# Altium project TIDA-01486.PrjPcb (part 2 of 2)
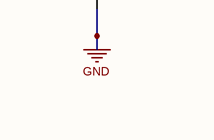
[diagram p8: TIDA-01486E1_Schematic.SchDoc, bottom right]

## Sheet TIDA-01486E1_Schematic.SchDoc: Schematic (continued)

### Library data of the parts
C1 C5 = GRM188R71H102JA01D: CAP, CERM, 1000 pF, 50 V,+/- 5%, X7R, 0603; Manufacturer: MuRata; Polarized: N; CompType: Capacitor; Value: 1000pF; U/M: EA; Cap_F: 0.000000001; Tolerance_%: 5; Value1: Unknown; VDC_V: 50; Value2: 50V; TaMin_C: -55; TaMax_C: 125; SizeArea_mm2: 1.28; SizeAreaWB_mm2: 4.68; SizeX_mm: 1.6; SizeY_mm: 0.8; SizeZ_mm: 1; AEC Category: Q200; SymbolVersion: 2008-07-09; PartNumber: GRM188R71H102JA01D; PackageReference: 0603; RoHS: Y; MountType: SMT; Technology: Ceramic; TempCo: X7R; Cap_Case: 0603; Published: 2008-06-19; Publisher: Texas Instruments; LatestRevisionDate: 2017-06-02; ComponentLink1Description: Datasheet link; ComponentLink1URL: http://psearch.murata.com/capacitor/product/GRM188R71H102JA01%23.pdf; Supplier 1: Digi-Key; Supplier Part Number 1: 490-9733-1-ND; Supplier 2: Mouser; Supplier Part Number 2: 81-GRM39X102J50D; AEC Qualified: N; AEC Grade: N/A
C9 C10 C17 C39 C?#27 C?#29 = GRM155R71E104KE14D: CAP, CERM, 0.1 µF, 25 V,+/- 10%, X7R, 0402; Manufacturer: MuRata; Polarized: N; CompType: Capacitor; Value: 0.1uF; U/M: EA; Cap_F: 0.0000001; Tolerance_%: 10; Value1: Unknown; VDC_V: 25; Value2: 25V; TaMin_C: -55; TaMax_C: 125; SizeArea_mm2: 0.5; SizeAreaWB_mm2: 3; SizeX_mm: 1; SizeZ_mm: 0.6; AEC Category: Q200; Green_Lifecycle: Active; Green_REACh: Passed; SymbolVersion: 2008-07-09; PartNumber: GRM155R71E104KE14D; PackageReference: 0402; RoHS: Y; MountType: SMT; Technology: Ceramic; TempCo: X7R; Cap_Case: 0402; SizeY_mm: 0.5; Published: 2008-06-19; Publisher: Texas Instruments; LatestRevisionDate: 2017-06-02; ComponentLink1Description: Datasheet link; ComponentLink1URL: http://search.murata.co.jp/Ceramy/image/img/A01X/G101/ENG/GRM155R71E104KE14-01.pdf; Supplier 1: Digi-Key; Supplier Part Number 1: 490-10698-1-ND; Supplier 2: Newark; Supplier Part Number 2: 31Y1751; Supplier 3: Mouser; Supplier Part Number 3: 81-GRM155R71E104KE4D; AEC Qualified: N; AEC Grade: N/A; Green_EU RoHS: Passed; Green_EU RoHS-2: Incomplete
C27 C31 C35 C40 C?#26 C?#28 = TPSA685K020R1000: CAP, TA, 6.8 µF, 20 V, +/- 10%, 1 ohm, SMD; Manufacturer: AVX; Polarized: Y; CompType: Capacitor; Value: 6.8uF; U/M: EA; Cap_F: 0.0000068; Tolerance_%: 10; Value1: 1 ohm; VDC_V: 20; Value2: 20V; ESR_ohm: 1; IRMS_A: 0.246; TaMin_C: -55; TaMax_C: 125; Cap_Case: A; SizeAreaWB_mm2: 10.92; SizeArea_mm2: 5.12; SizeX_mm: 3.2; SizeY_mm: 1.6; SizeZ_mm: 1.8; AEC Category: Q200; SymbolVersion: 2008-07-09; PartNumber: TPSA685K020R1000; PackageReference: 3216-18; RoHS: Y; MountType: SMT; Technology: TA; Series: TPS; Publisher: Texas Instruments; LatestRevisionDate: 2017-03-13; LatestRevisionNote: Updated supplier links; ComponentLink1Description: Datasheet link; ComponentLink1URL: http://www.avx.com/docs/masterpubs/tantniob.pdf; Supplier 1: Digi-Key; Supplier Part Number 1: 478-3094-1-ND; Supplier 2: Newark; Supplier Part Number 2: 75M2902; Supplier 3: Mouser; Supplier Part Number 3: 581-TPSA685K020R1000; AEC Qualified: ?
C47 = GMK107AB7105KAHT: CAP, CERM, 1 µF, 35 V,+/- 10%, X7R, AEC-Q200 Grade 0, 0603; Manufacturer: Taiyo Yuden; Polarized: N; CompType: Capacitor; Value: 1uF; U/M: EA; Cap_F: 0.000001; Tolerance_%: 10; Value1: Unknown; VDC_V: 35; Value2: 35V; TaMin_C: -55; TaMax_C: 125; SizeArea_mm2: 1.28; SizeAreaWB_mm2: 4.68; SizeX_mm: 1.6; SizeY_mm: 0.8; SizeZ_mm: 1; AEC Category: Q200; AEC Qualified: Y; AEC Grade: 0; SymbolVersion: 2008-07-09; PartNumber: GMK107AB7105KAHT; PackageReference: 0603; RoHS: Y; MountType: SMT; Technology: Ceramic; TempCo: X7R; Cap_Case: 0603; Published: 2008-06-19; Publisher: Texas Instruments; LatestRevisionDate: 2017-06-02; ComponentLink1Description: Datasheet link; ComponentLink1URL: http://www.yuden.co.jp/productdata/catalog/en/mlcc01_hq_e.pdf; Supplier 1: Digi-Key; Supplier Part Number 1: 587-3352-1-ND; Supplier 2: Newark; Supplier Part Number 2: 68X1426; Supplier 3: Mouser; Supplier Part Number 3: 963-GMK107AB7105KAHT
C?#1 = CAP_CER_GP_100nF_10%_50V_X7R_0603: Capacitor ceramic multilayer SMD 100nF 10% X7R 50V 0603; Manufacturer: TDK; Manufacturer Part Number: C1608X7R1H104K080AA; PartCode: 1; Type: standard; Case-EIA: 0603; Case-Metric: 1608; GR: BUCK; Part Number: CAP_CER_GP_100nF_10%_50V_X7R_0603; Class: Capacitor Ceramic Multilayer; Class Code: CAP_CER; Tolerance: 10%; Temperature_code: X7R; ComponentLink1Description: Datasheet; ComponentLink1URL: http://www.mouser.com/ds/2/400/mlcc_commercial_general_en-266370.pdf; ComponentLink2Description: Data; ComponentLink2URL: https://product.tdk.com/en/search/capacitor/ceramic/mlcc/info?part_no=C1608X7R1H104K080AA; ComponentLink3Description: Mouser; ComponentLink3URL: http://www.mouser.com/search/ProductDetail.aspx?R=0virtualkey0virtualkeyC1608X7R1H104K080AA
C?#2 C?#5 C?#9 = CAP_CER_GP_15uF_20%_16V_X5R_1210: Capacitor ceramic multilayer SMD 15uF 20% X5R 16V 1210; Manufacturer: TDK; Manufacturer Part Number: C3225X5R1C156M250AA; PartCode: 1; Type: standard; Case-EIA: 1210; Case-Metric: 3225; Part Number: CAP_CER_GP_15uF_20%_16V_X5R_1210; Class: Capacitor Ceramic Multilayer; Class Code: CAP_CER; Tolerance: 20%; Temperature_code: X5R; ComponentLink1Description: Datasheet; ComponentLink1URL: http://www.mouser.com/ds/2/400/mlcc_commercial_general_en-266370.pdf; ComponentLink2Description: Data; ComponentLink2URL: https://product.tdk.com/en/search/capacitor/ceramic/mlcc/info?part_no=C3225X5R1C156M250AA; ComponentLink3Description: Mouser; ComponentLink3URL: http://www.mouser.com/search/ProductDetail.aspx?R=0virtualkey0virtualkeyC3225X5R1C156M250AA
C?#3 C?#6 C?#7 C?#35 = CAP_CER_GP_100nF_20%_50V_X5R_0603: Capacitor ceramic multilayer SMD 100nF 20% X5R 50V 0603; Manufacturer: TDK; Manufacturer Part Number: C1608X5R1H104M080AA; PartCode: 1; Type: standard; Case-EIA: 0603; Case-Metric: 1608; Part Number: CAP_CER_GP_100nF_20%_50V_X5R_0603; Class: Capacitor Ceramic Multilayer; Class Code: CAP_CER; Tolerance: 20%; Temperature_code: X5R; ComponentLink1Description: Datasheet; ComponentLink1URL: http://www.mouser.com/ds/2/400/mlcc_commercial_general_en-266370.pdf; ComponentLink2Description: Data; ComponentLink2URL: https://product.tdk.com/en/search/capacitor/ceramic/mlcc/info?part_no=C1608X5R1H104M080AA; ComponentLink3Description: Mouser; ComponentLink3URL: http://www.mouser.com/search/ProductDetail.aspx?R=0virtualkey0virtualkeyC1608X5R1H104M080AA
C?#4 = CAP_CER_GP_68pF_1%_50V_C0G_0603: Capacitor ceramic multilayer SMD 68pF 1% C0G 50V 0603; Manufacturer: TDK; Manufacturer Part Number: C1608C0G1H680F080AA; PartCode: 1; Type: standard; Case-EIA: 0603; Case-Metric: 1608; GR: BUCK; Part Number: CAP_CER_GP_68pF_1%_50V_C0G_0603; Class: Capacitor Ceramic Multilayer; Class Code: CAP_CER; Tolerance: 1%; Temperature_code: C0G; ComponentLink1Description: Datasheet; ComponentLink1URL: http://www.mouser.com/ds/2/400/mlcc_commercial_general_en-266370.pdf; ComponentLink2Description: Data; ComponentLink2URL: https://product.tdk.com/en/search/capacitor/ceramic/mlcc/info?part_no=C1608C0G1H680F080AA; ComponentLink3Description: Mouser; ComponentLink3URL: http://www.mouser.com/search/ProductDetail.aspx?R=0virtualkey0virtualkeyC1608C0G1H680F080AA
C?#8 = CAP_CER_GP_1uF_20%_10V_X5R_0603: Capacitor ceramic multilayer SMD 1uF 20% X5R 10V 0603; Manufacturer: TDK; Manufacturer Part Number: C1608X5R1A105M080AC; PartCode: 1; Type: standard; Case-EIA: 0603; Case-Metric: 1608; Part Number: CAP_CER_GP_1uF_20%_10V_X5R_0603; Class: Capacitor Ceramic Multilayer; Class Code: CAP_CER; Tolerance: 20%; Temperature_code: X5R; ComponentLink1Description: Datasheet; ComponentLink1URL: http://www.mouser.com/ds/2/400/mlcc_commercial_general_en-266370.pdf
C?#10 C?#11 = GRM1555C1H102JA01D: CAP, CERM, 1000 pF, 50 V, +/- 5%, C0G/NP0, 0402; Manufacturer: MuRata; Value: 1000pF; Polarized: N; CompType: Capacitor; U/M: EA; Cap_F: 0.000000001; Tolerance_%: 5; Value1: Unknown; VDC_V: 50; Value2: 50V; TaMin_C: -55; TaMax_C: 125; Cap_Case: 0402; AEC Category: Q200; Published: 2008-06-19; LatestRevisionDate: 2016-04-09; PackageReference: 0402; Publisher: Texas Instruments; SymbolVersion: 2008-07-09; PartNumber: GRM1555C1H102JA01D; RoHS: Y; MountType: SMT; Technology: Ceramic; TempCo: C0G/NP0; ComponentLink1Description: Datasheet link; ComponentLink1URL: http://search.murata.co.jp/Ceramy/PnsearchViewAction.do?HnOFG=ON&HnNFG=ON&SEL_CNT=50&sLang=en&sKey=GRM1555C1H102JA01D&x=9&y=9&search=startwith; Supplier 1: Digi-Key; Supplier Part Number 1: 490-3244-1-ND; Supplier 2: Mouser; Supplier Part Number 2: 81-GRM1555C1H102JA1D; Supplier 3: Farnell; Supplier Part Number 3: 8819556; AEC Qualified: ?
C?#12 = GRM188R71A105KA61D: CAP, CERM, 1 µF, 10 V, +/- 10%, X7R, 0603; Manufacturer: MuRata; Polarized: N; CompType: Capacitor; Value: 1uF; U/M: EA; Cap_F: 0.000001; Tolerance_%: 10; ESR_ohm: 0.011; Value1: 0.011 ohm; Value2: 10V; TaMin_C: -55; TaMax_C: 125; Cap_Case: 0603; AEC Category: Q200; SizeArea_mm2: 1.28; SizeAreaWB_mm2: 4.68; SizeX_mm: 1.6; SizeY_mm: 0.8; SizeZ_mm: 1; SymbolVersion: 2008-07-09; PartNumber: GRM188R71A105KA61D; PackageReference: 0603; RoHS: Y; VDC_V: 10; MountType: SMT; Technology: Ceramic; TempCo: X7R; Published: 2008-06-19; Publisher: Texas Instruments; LatestRevisionDate: 2016-05-21; ComponentLink1Description: Datasheet link; ComponentLink1URL: http://search.murata.co.jp/Ceramy/PnsearchViewAction.do?HnOFG=ON&HnNFG=ON&SEL_CNT=50&sLang=en&sKey=GRM188R71A105KA61D&x=9&y=9&search=startwith; Supplier 1: Digi-Key; Supplier Part Number 1: 490-3899-1-ND; Supplier 2: Mouser; Supplier Part Number 2: 81-GRM188R71A105KA1D; Supplier 3: Farnell; Supplier Part Number 3: 1845766; AEC Qualified: ?
C?#13-C?#15 = GRM188R71A105KA61D: CAP, CERM, 1 µF, 10 V, +/- 10%, X7R, 0603; Manufacturer: MuRata; Polarized: N; CompType: Capacitor; Value: 1uF; U/M: EA; Cap_F: 0.000001; Tolerance_%: 10; ESR_ohm: 0.011; Value1: 0.011 ohm; Value2: 10V; TaMin_C: -55; TaMax_C: 125; Cap_Case: 0603; SizeArea_mm2: 1.28; SizeAreaWB_mm2: 4.68; SizeX_mm: 1.6; SizeY_mm: 0.8; SizeZ_mm: 1; AEC Category: Q200; SymbolVersion: 2008-07-09; PartNumber: GRM188R71A105KA61D; PackageReference: 0603; RoHS: Y; VDC_V: 10; MountType: SMT; Technology: Ceramic; TempCo: X7R; Published: 2008-06-19; Publisher: Texas Instruments; LatestRevisionDate: 2016-05-21; ComponentLink1Description: Datasheet link; ComponentLink1URL: http://search.murata.co.jp/Ceramy/PnsearchViewAction.do?HnOFG=ON&HnNFG=ON&SEL_CNT=50&sLang=en&sKey=GRM188R71A105KA61D&x=9&y=9&search=startwith; Supplier 1: Digi-Key; Supplier Part Number 1: 490-3899-1-ND; Supplier 2: Mouser; Supplier Part Number 2: 81-GRM188R71A105KA1D; Supplier 3: Farnell; Supplier Part Number 3: 1845766; AEC Qualified: ?
C?#16 C?#17 = GRM21BR60J476ME15L: CAP, CERM, 47 µF, 6.3 V, +/- 20%, X5R, 0805; Manufacturer: MuRata; Polarized: N; CompType: Capacitor; Value: 47uF; U/M: EA; Cap_F: 0.000047; Tolerance_%: 20; Value1: Unknown; VDC_V: 6.3; Value2: 6.3V; TaMin_C: -55; TaMax_C: 85; Cap_Case: 0805; AEC Category: Q200; SizeArea_mm2: 2.5; SizeAreaWB_mm2: 6.75; SizeX_mm: 2; SizeY_mm: 1.25; SizeZ_mm: 1.45; SymbolVersion: 2008-07-09; PartNumber: GRM21BR60J476ME15L; PackageReference: 0805; RoHS: Y; MountType: SMT; Technology: Ceramic; TempCo: X5R; Published: 2008-06-19; Publisher: Texas Instruments; LatestRevisionDate: 2016-05-21; ComponentLink1Description: Datasheet link; ComponentLink1URL: http://psearch.en.murata.com/capacitor/product/GRM21BR60J476ME15%23.pdf; Supplier 1: Digi-Key; Supplier Part Number 1: 490-9960-1-ND; Supplier 2: Mouser; Supplier Part Number 2: 81-GRM21BR60J476ME5L; Supplier 3: Farnell; Supplier Part Number 3: 2362109; AEC Qualified: N; AEC Grade: N/A
C?#18-C?#21 C?#34 = GRM155R71C104KA88D: CAP, CERM, 0.1 µF, 16 V, +/- 10%, X7R, 0402; Manufacturer: MuRata; Value: 0.1uF; Polarized: N; CompType: Capacitor; U/M: EA; Cap_F: 0.0000001; Tolerance_%: 10; Value1: Unknown; VDC_V: 16; Value2: 16V; TaMin_C: -55; TaMax_C: 125; Cap_Case: 0402; AEC Category: Q200; Published: 2008-06-19; LatestRevisionDate: 2016-03-01; PackageReference: 0402; Publisher: Texas Instruments; SymbolVersion: 2008-07-09; PartNumber: GRM155R71C104KA88D; RoHS: Y; MountType: SMT; Technology: Ceramic; TempCo: X7R; ComponentLink1Description: Datasheet link; ComponentLink1URL: http://search.murata.co.jp/Ceramy/PnsearchViewAction.do?HnOFG=ON&HnNFG=ON&SEL_CNT=50&sLang=en&sKey=GRM155R71C104KA88D&x=9&y=9&search=startwith; Supplier 1: Digi-Key; Supplier Part Number 1: 490-3261-1-ND; Supplier 2: Mouser; Supplier Part Number 2: 81-GRM155R71C104KA88; Supplier 3: Farnell; Supplier Part Number 3: 8819742; AEC Qualified: ?
C?#22-C?#25 = GRM1555C1H120JA01D: CAP, CERM, 12 pF, 50 V, +/- 5%, C0G/NP0, 0402; Manufacturer: MuRata; Polarized: N; CompType: Capacitor; Value: 12pF; U/M: EA; Cap_F: 0.000000000012; Tolerance_%: 5; Value1: Unknown; VDC_V: 50; Value2: 50V; TaMin_C: -55; TaMax_C: 125; SizeArea_mm2: 0.5; SizeAreaWB_mm2: 3; SizeX_mm: 1; SizeZ_mm: 0.6; AEC Category: Q200; SymbolVersion: 2008-07-09; PartNumber: GRM1555C1H120JA01D; PackageReference: 0402; RoHS: Y; MountType: SMT; Technology: Ceramic; TempCo: C0G/NP0; Cap_Case: 0402; SizeY_mm: 0.5; Published: 2008-06-19; Publisher: Texas Instruments; ComponentLink1Description: Datasheet link; ComponentLink1URL: http://search.murata.co.jp/Ceramy/PnsearchViewAction.do?HnOFG=ON&HnNFG=ON&SEL_CNT=50&sLang=en&sKey=GRM1555C1H120JA01D&x=9&y=9&search=startwith; Supplier 1: Mouser; Supplier Part Number 1: 81-GRM1555C1H120JA1D; Supplier 2: Farnell; Supplier Part Number 2: 1828875; Supplier 3: Newark; Supplier Part Number 3: 14T3292; AEC Qualified: ?
  C?#22 C?#23: LatestRevisionDate: 2017-01-30
  C?#24 C?#25: LatestRevisionDate: 2016-11-28
C?#30 C?#33 = GRM1555C1H120JA01D: CAP, CERM, 12 pF, 50 V, +/- 5%, C0G/NP0, 0402; Manufacturer: MuRata; Value: 12pF; Polarized: N; CompType: Capacitor; U/M: EA; Cap_F: 0.000000000012; Tolerance_%: 5; Value1: Unknown; VDC_V: 50; Value2: 50V; TaMin_C: -55; TaMax_C: 125; Cap_Case: 0402; AEC Category: Q200; Published: 2008-06-19; LatestRevisionDate: 2016-04-09; PackageReference: 0402; Publisher: Texas Instruments; SymbolVersion: 2008-07-09; PartNumber: GRM1555C1H120JA01D; RoHS: Y; MountType: SMT; Technology: Ceramic; TempCo: C0G/NP0; ComponentLink1Description: Datasheet link; ComponentLink1URL: http://search.murata.co.jp/Ceramy/PnsearchViewAction.do?HnOFG=ON&HnNFG=ON&SEL_CNT=50&sLang=en&sKey=GRM1555C1H120JA01D&x=9&y=9&search=startwith; Supplier 1: Mouser; Supplier Part Number 1: 81-GRM1555C1H120JA1D; Supplier 2: Farnell; Supplier Part Number 2: 1828875; Supplier 3: Newark; Supplier Part Number 3: 14T3292; AEC Qualified: ?
C?#31 C?#32 = EMK107BB7225MA-T: CAP, CERM, 2.2 µF, 16 V,+/- 10%, X7R, 0603; Manufacturer: Taiyo Yuden; Polarized: N; CompType: Capacitor; Value: 2.2uF; U/M: EA; Cap_F: 0.0000022; Tolerance_%: 10; Value1: Unknown; VDC_V: 16; Value2: 16V; TaMin_C: -55; TaMax_C: 125; SizeArea_mm2: 1.28; SizeAreaWB_mm2: 4.68; SizeX_mm: 1.6; SizeY_mm: 0.8; SizeZ_mm: 1; AEC Category: Q200; SymbolVersion: 2008-07-09; PartNumber: EMK107BB7225MA-T; PackageReference: 0603; RoHS: Y; MountType: SMT; Technology: Ceramic; TempCo: X7R; Cap_Case: 0603; Published: 2008-06-19; Publisher: Texas Instruments; LatestRevisionDate: 2017-06-02; ComponentLink1Description: Datasheet link; ComponentLink1URL: http://www.yuden.co.jp/productdata/catalog/en/mlcc_all_e.pdf; Supplier 1: Digi-Key; Supplier Part Number 1: 587-4864-1-ND; Supplier 2: Mouser; Supplier Part Number 2: 963-EMK107BB7225MA-T; AEC Qualified: N; AEC Grade: N/A
Cin?#1 Cin?#2 Cin_?#1-Cin_?#4 = C0603C105K8PACTU: Manufacturer Name: Kemet; PackageReference: C0603C105K8PACTU; Manufacturer Part Number: C0603C105K8PACTU
Cout?#1 Cout?#2 = CL32B106KBJNNWE: Manufacturer Name: Samsung Electro-Mechanics; PackageReference: CL32B106KBJNNWE; Manufacturer Part Number: CL32B106KBJNNWE
D1 = DFLS130L-7: Diode, Schottky, 30 V, 1 A, PowerDI123; Manufacturer: Diodes Inc.; U/M: EA; Vf_V: 0.31; Value: 30V; Value1: 1A; Value2: 0.31V; Io_A: 1; Vr_V: 30; TJmax_C: 125; SizeAreaWB_mm2: 13.066; SizeArea_mm2: 6.586; SizeX_mm: 3.7; SizeY_mm: 1.78; SizeZ_mm: 0.98; AEC Category: Q101; AEC Qualified: N; Green_Lifecycle: Not Set; Green_REACh: Incomplete; CompType: Diode; SymbolVersion: 2008-12-08; PartNumber: DFLS130L-7; PackageReference: PowerDI123; MountType: SMT; Type: Schottky; RoHS: Y; Published: 2008-06-26; Publisher: Texas Instruments; LatestRevisionDate: 2017-05-30; ComponentLink1Description: Datasheet link; ComponentLink1URL: http://www.diodes.com/_files/datasheets/ds30492.pdf; Supplier 1: Digi-Key; Supplier Part Number 1: DFLS130LDICT-ND; Supplier 2: Newark; Supplier Part Number 2: 12T1975; Supplier 3: Mouser; Supplier Part Number 3: 621-DFLS130L; Green_EU RoHS: Incomplete; Green_EU RoHS-2: Incomplete
D5-D7 = CMP-0029001-1: Diode, Ultrafast, 100 V, 0.15 A, SOD-123; Manufacturer: Diodes Inc.; Io_A: 1.5dA; Green_Lifecycle: Active; SizeAreaWB_mm2: 13.095; Vr_V: 100V; Green_REACh: Passed; Value1: 0.15A; TJmax_C: 150°C; U/M: EA; Value: 100V; SizeZ_mm: 1.35; SizeX_mm: 3.85; SizeY_mm: 1.7; Vf_V: 1.25V; SizeArea_mm2: 6.545; AEC Category: Q101; ComponentLink1URL: http://www.diodes.com/datasheets/ds30086.pdf; Supplier Part Number 2: 621-1N4148W-F; Publisher: Texas Instruments; Supplier 2: Mouser; Supplier Part Number 3: 1776392; Supplier 3: Farnell; Published: 2008-06-26; RoHS: Y; MountType: SMT; Green_EU RoHS-2: Passed; Supplier 1: Digi-Key; Green_EU RoHS: Passed; PackageReference: SOD-123; Value2: 1.25V; CompType: Diode; Type: Ultrafast; LatestRevisionDate: 2017-05-08; PartNumber: 1N4148W-7-F; AEC Qualified: ?; ComponentLink1Description: Datasheet link; Supplier Part Number 1: 1N4148W-FDICT-ND
D?#1 = S3A: Part Number: S3A; Manufacturer: Fairchild; PartCode: 3; Type: standard; Class: Si-Diode; STD Price: 0.114; Class Code: Diode; Case-EIA: SMC; Manufacturer Part Number: S3A
D?#2 = LTST-C190KSKT: LED ULTRA-BRIGHT YELLOW SMT 0603; Manufacturer: Lite ON; PartCode: 1; Type: standard; Class: LED YEL; STD Price: 0.057; Case-EIA: 0603; GR: MCU; Manufacturer Part Number: LTST-C190KSKT; Class Code: LED
J?#1 = HEADER VERTICAL 0.100 SQ KEYED FRICT.LOCK 4P MOLEX 22-23-2041: PartCode: 2; ID: 17; Value: 1x4 0.100; Case-EIA: Header 0.100; Recommended: yes; STD Price: 0.117; Part Number: HEADER VERTICAL 0.100 SQ KEYED FRICT.LOCK 4P MOLEX 22-23-2041; Type: Standard; Class: HEADER VERTICAL; Class Code: HEADER VERTICAL; Connactor Type: 0.100 SQ KEYED FRICT.LOCK; Pin QTY: 4P; Manufacturer: MOLEX; Manufacturer Part Number: 22-23-2041; ComponentLink1Description: Datasheet; ComponentLink1URL: http://10.3.1.109/ftp/public/Electronics/Datasheet/022232031_sd.pdf; ComponentLink2Description: Catalog; ComponentLink2URL: http://10.3.1.109/ftp/public/Electronics/Datasheet/1686.pdf; DatasheetName: 022232031_sd.pdf
J?#2 = MSP430PROG: ID: 99; Class: CON HEADER; Connactor Type: 100mls pads; Value: 1x4; Pin QTY: 4P; STD Price: 0; Part Number: MSP430PROG; Type: Standard (No BOM); Class Code: CON HEADER; Case-EIA: 100mls pads
L?#1 = ME3220-222MLB: Power Inductor ME3220-222MLB; Manufacturer: Coilcraft; PartCode: 2; ID: 11; Class Code: IND; Resistance: 104mOhm; Rated Current: 1.5; GR: BUCK; Part Number: ME3220-222MLB; Class: Power Inductor; Case-EIA: ME3220; ComponentLink1Description: Datasheet
L?#2 L?#5 = NPI43C120MTRF: Manufacturer Name: NIC Components; PackageReference: NPI43C120MTRF; Manufacturer Part Number: NPI43C120MTRF
L?#3 L?#4 = MPZ2012S601A: Ferrite Bead, 600 ohm @ 100 MHz, 2 A, 0805; Manufacturer: TDK; Alternate PartNumber: MPZ2012S601AT000; Imax_A: 2; DCR_ohm: 0.1; Value1: 0.1 ohm; Value2: 2A; ZTyp@100MHz_Ohm: 600; CompType: Ferrite Bead; SymbolVersion: 2009-06-02; PartNumber: MPZ2012S601A; MountType: SMT; PackageReference: 0805; Published: 2014-04-30; Publisher: Texas Instruments; LatestRevisionDate: 2016-04-05; ComponentLink1Description: Datasheet link; ComponentLink1URL: http://www.tdk.co.jp/tefe02/e9413_mpz.pdf; RoHS: Y; Supplier 1: Digi-Key; Supplier Part Number 1: 445-2206-1-ND; Supplier 2: Mouser; Supplier Part Number 2: 810-MPZ2012S601A; Supplier 3: Farnell; Supplier Part Number 3: 1669753
NT?#1-NT?#3 = Net-Tie: Single point connection between nets.; SymbolCreator: codlsc; SymbolVersion: 2009-07-01; MountType: SMT; PackageReference: N/A; Publisher: Texas Instruments; LatestRevisionDate: 2015-10-18; LatestRevisionNote: Added Alternate PartNumber and Alternate Manufacturer parameters to appropriate components.
R1 = RC0603FR-071KL: RES, 1.00 k, 1%, 0.1 W, 0603; Manufacturer: Yageo America; CompType: Resistor; Value: 1.00k; Res_ohm: 1000; Value_Code: 1k00; Tolerance_%: 1; Power_W: 0.1; Value2: 0.1W; VDC_V: 150; TempCo: 200 ppm/C; SizeArea_mm2: 1.28; SizeX_mm: 1.6; SizeY_mm: 0.8; EIA_Code: E96; U/M: EA; AEC Category: Q200; Green_Lifecycle: Active; Green_REACh: Passed; SymbolVersion: 2009-05-29; PartNumber: RC0603FR-071KL; PackageReference: 0603; RoHS: Y; Value1: 1%; MountType: SMT; Technology: Thick Film; SizeZ_mm: 1; Published: 2008-06-26; Publisher: Texas Instruments; LatestRevisionDate: 2017-05-31; ComponentLink1Description: Datasheet link; ComponentLink1URL: http://www.yageo.com/pdf/Pu-RC0603_51_PbFree_L_2.pdf; Supplier 1: Digi-Key; Supplier Part Number 1: 311-1.00KHRCT-ND; Supplier 2: Mouser; Supplier Part Number 2: 603-RC0603FR-071KL; Supplier 3: Farnell; Supplier Part Number 3: 9238484; AEC Qualified: ?; Green_EU RoHS: Passed with Exemption; Green_EU RoHS-2: Passed
R5 R13 = CRCW0603866RFKEA: RES, 866, 1%, 0.1 W, 0603; Manufacturer: Vishay-Dale; CompType: Resistor; Value: 866; Value_Code: 866R; Tolerance_%: 1; Power_W: 0.1; Value2: 0.1W; VDC_V: 75; TempCo: 100 ppm/C; SizeArea_mm2: 1.28; SizeX_mm: 1.6; SizeY_mm: 0.8; EIA_Code: E96; U/M: EA; AEC Category: Q200; Green_Lifecycle: Active; Green_REACh: Passed; SymbolVersion: 2009-05-29; PartNumber: CRCW0603866RFKEA; PackageReference: 0603; RoHS: Y; Res_ohm: 866; Value1: 1%; MountType: SMT; Technology: Thick Film; SizeZ_mm: 1; Published: 2008-06-26; Publisher: Texas Instruments; LatestRevisionDate: 2017-05-31; ComponentLink1Description: Datasheet link; ComponentLink1URL: http://www.vishay.com/docs/20035/dcrcwe3.pdf; Supplier 1: Digi-Key; Supplier Part Number 1: 541-866HCT-ND; Supplier 2: Newark; Supplier Part Number 2: 52K8754; Supplier 3: Mouser; Supplier Part Number 3: 71-CRCW0603-866-E3; AEC Qualified: ?; Green_EU RoHS: Passed with Exemption; Green_EU RoHS-2: Passed
R9 R17 = CRCW060395R3FKEA: RES, 95.3, 1%, 0.1 W, 0603; Manufacturer: Vishay-Dale; CompType: Resistor; Value: 95.3; Value_Code: 95R3; Tolerance_%: 1; Power_W: 0.1; Value2: 0.1W; VDC_V: 75; TempCo: 100 ppm/C; SizeArea_mm2: 1.28; SizeX_mm: 1.6; SizeY_mm: 0.8; EIA_Code: E96; U/M: EA; AEC Category: Q200; SymbolVersion: 2009-05-29; PartNumber: CRCW060395R3FKEA; PackageReference: 0603; RoHS: Y; Res_ohm: 95.3; Value1: 1%; MountType: SMT; Technology: Thick Film; SizeZ_mm: 1; Published: 2008-06-26; Publisher: Texas Instruments; LatestRevisionDate: 2017-05-31; ComponentLink1Description: Datasheet link; ComponentLink1URL: http://www.vishay.com/docs/20035/dcrcwe3.pdf; Supplier 1: Digi-Key; Supplier Part Number 1: 541-95.3HCT-ND; Supplier 2: Mouser; Supplier Part Number 2: 71-CRCW0603-95.3-E3; Supplier 3: Farnell; Supplier Part Number 3: 1878639; AEC Qualified: ?
R21 = RT0603BRD07100KL: RES, 100 k, 0.1%, 0.1 W, 0603; Manufacturer: Yageo America; CompType: Resistor; Value: 100k; Res_ohm: 100000; Tolerance_%: 0.1; Value2: 0.1W; VDC_V: 75; TempCo: 25 ppm/C; SizeArea_mm2: 1.28; SizeX_mm: 1.6; SizeY_mm: 0.8; SizeZ_mm: 1; EIA_Code: E192; U/M: EA; AEC Category: Q200; Green_Lifecycle: Active; Green_REACh: Passed; SymbolVersion: 2009-05-29; PartNumber: RT0603BRD07100KL; PackageReference: 0603; RoHS: Y; Value_Code: 100k; Value1: 0.1%; Power_W: 0.1; MountType: SMT; Technology: Thin Film; Published: 2008-06-26; Publisher: Texas Instruments; LatestRevisionDate: 2017-05-31; ComponentLink1Description: Datasheet link; ComponentLink1URL: http://www.yageo.com/pdf/PYu-RT_1-to-0.05_RoHS_L_3.pdf; Supplier 1: Mouser; Supplier Part Number 1: 603-RT0603BRD07100KL; AEC Qualified: ?; Green_EU RoHS: Passed with Exemption; Green_EU RoHS-2: Passed
R25 = RT0603BRD0724K9L: RES, 24.9 k, 0.1%, 0.1 W, 0603; Manufacturer: Yageo America; CompType: Resistor; Value: 24.9k; Res_ohm: 24900; Value_Code: 24k9; Tolerance_%: 0.1; Value2: 0.1W; VDC_V: 75; TempCo: 25 ppm/C; SizeArea_mm2: 1.28; SizeX_mm: 1.6; SizeY_mm: 0.8; SizeZ_mm: 1; EIA_Code: E192; U/M: EA; AEC Category: Q200; SymbolVersion: 2009-05-29; PartNumber: RT0603BRD0724K9L; PackageReference: 0603; RoHS: Y; Value1: 0.1%; Power_W: 0.1; MountType: SMT; Technology: Thin Film; Published: 2008-06-26; Publisher: Texas Instruments; LatestRevisionDate: 2017-05-31; ComponentLink1Description: Datasheet link; ComponentLink1URL: http://www.yageo.com/pdf/PYu-RT_1-to-0.05_RoHS_L_3.pdf; AEC Qualified: ?
R29 = RMCF0603ZT0R00: RES, 0, 1%, 0.1 W, AEC-Q200 Grade 0, 0603; Manufacturer: Stackpole Electronics Inc; CompType: Resistor; Value: 0; Tolerance_%: 1; Power_W: 0.1; Value2: 0.1W; TempCo: ppm/C; SizeArea_mm2: 1.28; SizeX_mm: 1.6; SizeY_mm: 0.8; U/M: EA; AEC Category: Q200; AEC Qualified: Y; Green_Lifecycle: Active; Green_REACh: Passed; SymbolVersion: 2009-05-29; PartNumber: RMCF0603ZT0R00; PackageReference: 0603; RoHS: Y; Res_ohm: 0; Value_Code: 0; Value1: 1%; MountType: SMT; Technology: Thick Film; SizeZ_mm: 1; Published: 2008-06-26; Publisher: Texas Instruments; LatestRevisionDate: 2017-05-31; ComponentLink1Description: Datasheet link; ComponentLink1URL: https://www.seielect.com/Catalog/SEI-RMCF_RMCP.pdf; Supplier 1: Digi-Key; Supplier Part Number 1: RMCF0603ZT0R00CT-ND; AEC Grade: 0; Green_EU RoHS: Passed with Exemption; Green_EU RoHS-2: Incomplete
R37 = CRCW0402200RFKED: RES, 200, 1%, 0.063 W, 0402; Manufacturer: Vishay-Dale; CompType: Resistor; Value: 200; Value_Code: 200R; Tolerance_%: 1; Power_W: 0.063; Value2: 0.063W; VDC_V: 50; TempCo: 100 ppm/C; SizeArea_mm2: 0.5; SizeZ_mm: 0.6; EIA_Code: E96; U/M: EA; AEC Category: Q200; Green_Lifecycle: Active; Green_REACh: Passed; SymbolVersion: 2009-05-29; PartNumber: CRCW0402200RFKED; PackageReference: 0402; RoHS: Y; Res_ohm: 200; Value1: 1%; MountType: SMT; Technology: Thick Film; SizeX_mm: 1; SizeY_mm: 0.5; Published: 2008-06-26; Publisher: Texas Instruments; LatestRevisionDate: 2017-06-03; ComponentLink1Description: Datasheet link; ComponentLink1URL: http://www.vishay.com/docs/20035/dcrcwe3.pdf; Supplier 1: Digi-Key; Supplier Part Number 1: 541-200LCT-ND; Supplier 2: Newark; Supplier Part Number 2: 52K6826; Supplier 3: Mouser; Supplier Part Number 3: 71-CRCW0402-200-E3; AEC Qualified: ?; Green_EU RoHS: Passed with Exemption; Green_EU RoHS-2: Passed
R39 = CRCW060310R0JNEAHP: RES, 10, 5%, 0.25 W, 0603; Manufacturer: Vishay-Dale; CompType: Resistor; Value: 10; Value_Code: 10R0; Tolerance_%: 5; Power_W: 0.25; Value2: 0.25W; VDC_V: 75; TempCo: 200 ppm/C; SizeArea_mm2: 1.28; SizeX_mm: 1.6; SizeY_mm: 0.8; SizeZ_mm: 1; EIA_Code: E24; U/M: EA; AEC Category: Q200; Green_Lifecycle: Active; Green_REACh: Passed; SymbolVersion: 2009-05-29; PartNumber: CRCW060310R0JNEAHP; PackageReference: 0603; RoHS: Y; Res_ohm: 10; Value1: 5%; MountType: SMT; Technology: Thick Film; Published: 2008-06-26; Publisher: Texas Instruments; LatestRevisionDate: 2017-05-31; ComponentLink1Description: Datasheet link; ComponentLink1URL: http://www.vishay.com/docs/20043/crcwhpe3.pdf; Supplier 1: Digi-Key; Supplier Part Number 1: 541-10SACT-ND; Supplier 2: Mouser; Supplier Part Number 2: 71-CRCW060310R0JNEAH; Supplier 3: Farnell; Supplier Part Number 3: 24T7074; AEC Qualified: ?; Green_EU RoHS: Passed with Exemption; Green_EU RoHS-2: Passed
R?#1 = RES_100K_0603_1%: Thick film Resistor 100K 1% 0603; Manufacturer: Panasonic; Manufacturer Part Number: ERJ3EKF1003V; PartCode: 1; Class Code: RES; Rated Voltage: 75V; Power: 0.1W; Case-Metric: 1608; Case-EIA: 0603; STD Price: 0.004; GR: BUCK; VALUE: 100K; Part Number: RES_100K_0603_1%; Type: Standard; Class: Thick film Resistor; Tolerance: 1%; ComponentLink1Description: Datasheet; ComponentLink1URL: http://10.3.1.109/ftp/public/Electronics/Datasheet/Panasonic%20Precision%20Thick%20Film%20Chip%20Resistors%20ERJ.pdf
R?#2 = RES_13.3K_0603_1%: Thick film Resistor 13.3K 1% 0603; Manufacturer: Panasonic; Manufacturer Part Number: ERJ3EKF1332V; PartCode: 1; Class Code: RES; Rated Voltage: 75V; Power: 0.1W; Case-Metric: 1608; Case-EIA: 0603; STD Price: 0.004; VALUE: 13.3K; Part Number: RES_13.3K_0603_1%; Type: Standard; Class: Thick film Resistor; Tolerance: 1%; ComponentLink1Description: Datasheet; ComponentLink1URL: http://10.3.1.109/ftp/public/Electronics/Datasheet/Panasonic%20Precision%20Thick%20Film%20Chip%20Resistors%20ERJ.pdf
R?#3 R?#4 = RES_47K_0603: Thick film Resistor 47K 5% 0603; Manufacturer: Panasonic; Manufacturer Part Number: ERJ-3GEYJ473V; PartCode: 1; Class Code: RES; Rated Voltage: 75V; Power: 0.1W; Case-Metric: 1608; Case-EIA: 0603; STD Price: 0.003; Part Number: RES_47K_0603; Type: Standard; Class: Thick film Resistor; ComponentLink1Description: Datasheet; ComponentLink1URL: http://10.3.1.109/ftp/public/Electronics/Datasheet/Panasonic%20ERJ%20Thick%20Film%20Chip%20Resistors.pdf
R?#5-R?#8 = RES_0R_0603_1%: Thick film Resistor 0R 0 0603; Manufacturer: Panasonic; Manufacturer Part Number: ERJ3EKF0000V; PartCode: 1; Class Code: RES; Tolerance: 0; Rated Voltage: 75V; Power: 0.1W; Case-Metric: 1608; Case-EIA: 0603; STD Price: 0.004; VALUE: 0R; Part Number: RES_0R_0603_1%; Type: Standard; Class: Thick film Resistor; ComponentLink1Description: Datasheet; ComponentLink1URL: http://10.3.1.109/ftp/public/Electronics/Datasheet/Panasonic%20Precision%20Thick%20Film%20Chip%20Resistors%20ERJ.pdf
R?#9 R?#10 = CRCW0402100KJNED: RES, 100 k, 5%, 0.063 W, 0402; Manufacturer: Vishay-Dale; Value: 100k; CompType: Resistor; Res_ohm: 100000; Tolerance_%: 5; Power_W: 0.063; Value2: 0.063W; VDC_V: 50; TempCo: 200 ppm/C; EIA_Code: E24; U/M: EA; Published: 2008-06-26; LatestRevisionDate: 2014-07-21; PackageReference: 0402; Publisher: Texas Instruments; SymbolVersion: 2009-05-29; PartNumber: CRCW0402100KJNED; RoHS: Y; Value_Code: 100k; Value1: 5%; MountType: SMT; Technology: Thick Film; ComponentLink1Description: Datasheet link; ComponentLink1URL: http://www.vishay.com/docs/20035/dcrcwe3.pdf; Supplier 1: Mouser; Supplier Part Number 1: 71-CRCW0402J-100K-E3; Supplier 2: Farnell; Supplier Part Number 2: 1652738; Supplier 3: Newark; Supplier Part Number 3: 59M6699
R?#11 R?#17 = CRCW040222R0JNED: RES, 22, 5%, 0.063 W, 0402; Manufacturer: Vishay-Dale; Value: 22; CompType: Resistor; Value_Code: 22R0; Tolerance_%: 5; Power_W: 0.063; Value2: 0.063W; VDC_V: 50; TempCo: 200 ppm/C; EIA_Code: E24; U/M: EA; AEC Category: Q200; Published: 2008-06-26; LatestRevisionDate: 2016-04-09; PackageReference: 0402; Publisher: Texas Instruments; SymbolVersion: 2009-05-29; PartNumber: CRCW040222R0JNED; RoHS: Y; Res_ohm: 22; Value1: 5%; MountType: SMT; Technology: Thick Film; ComponentLink1Description: Datasheet link; ComponentLink1URL: http://www.vishay.com/docs/20035/dcrcwe3.pdf; Supplier 1: Digi-Key; Supplier Part Number 1: 541-22JCT-ND; Supplier 2: Mouser; Supplier Part Number 2: 71-CRCW0402J-22-E3; Supplier 3: Farnell; Supplier Part Number 3: 1514685; AEC Qualified: ?
R?#12 = RES_220R_0603: Thick film Resistor 220R 5% 0603; Manufacturer: Panasonic; Manufacturer Part Number: ERJ-3GEYJ221V; PartCode: 1; Class Code: RES; Rated Voltage: 75V; Power: 0.1W; Case-Metric: 1608; Case-EIA: 0603; STD Price: 0.003; Part Number: RES_220R_0603; Type: Standard; Class: Thick film Resistor; ComponentLink1Description: Datasheet; ComponentLink1URL: http://10.3.1.109/ftp/public/Electronics/Datasheet/Panasonic%20ERJ%20Thick%20Film%20Chip%20Resistors.pdf
R?#13-R?#16 = RES_1.00M_0603_1%: Thick film Resistor 1.00M 1% 0603; Manufacturer: Panasonic; Manufacturer Part Number: ERJ3EKF1004V; PartCode: 1; Class Code: RES; Rated Voltage: 75V; Power: 0.1W; Case-Metric: 1608; Case-EIA: 0603; STD Price: 0.004; VALUE: 1.00M; Part Number: RES_1.00M_0603_1%; Type: Standard; Class: Thick film Resistor; Tolerance: 1%; ComponentLink1Description: Datasheet; ComponentLink1URL: http://10.3.1.109/ftp/public/Electronics/Datasheet/Panasonic%20Precision%20Thick%20Film%20Chip%20Resistors%20ERJ.pdf
R?#18 R?#26 = RES_10K_0603: Thick film Resistor 10K 5% 0603; Manufacturer: Panasonic; Manufacturer Part Number: ERJ-3GEYJ103V; PartCode: 1; Class Code: RES; Rated Voltage: 75V; Power: 0.1W; Case-Metric: 1608; Case-EIA: 0603; STD Price: 0.003; Part Number: RES_10K_0603; Type: Standard; Class: Thick film Resistor; ComponentLink1Description: Datasheet; ComponentLink1URL: http://10.3.1.109/ftp/public/Electronics/Datasheet/Panasonic%20ERJ%20Thick%20Film%20Chip%20Resistors.pdf
R?#19 = RES_100R_0603: Thick film Resistor 100R 5% 0603; Manufacturer: Panasonic; Manufacturer Part Number: ERJ-3GEYJ101V; PartCode: 1; Class Code: RES; Rated Voltage: 75V; Power: 0.1W; Case-Metric: 1608; Case-EIA: 0603; STD Price: 0.003; Part Number: RES_100R_0603; Type: Standard; Class: Thick film Resistor; ComponentLink1Description: Datasheet; ComponentLink1URL: http://10.3.1.109/ftp/public/Electronics/Datasheet/Panasonic%20ERJ%20Thick%20Film%20Chip%20Resistors.pdf
R?#20 = RES_1.0K_0603: Thick film Resistor 1.0K 5% 0603; Manufacturer: Panasonic; Manufacturer Part Number: ERJ-3GEYJ102V; PartCode: 1; Class Code: RES; Rated Voltage: 75V; Power: 0.1W; Case-Metric: 1608; Case-EIA: 0603; STD Price: 0.003; Part Number: RES_1.0K_0603; Type: Standard; Class: Thick film Resistor; ComponentLink1Description: Datasheet; ComponentLink1URL: http://10.3.1.109/ftp/public/Electronics/Datasheet/Panasonic%20ERJ%20Thick%20Film%20Chip%20Resistors.pdf
R?#21 R?#23 = RES_0R_0603: Thick film Resistor 0R  0603; Manufacturer: Panasonic; Manufacturer Part Number: ERJ-3GEY0R00V; PartCode: 1; Class Code: RES; Rated Voltage: 75V; Power: 0.1W; Case-Metric: 1608; Case-EIA: 0603; STD Price: 0.003; Part Number: RES_0R_0603; Type: Standard; Class: Thick film Resistor; ComponentLink1Description: Datasheet; ComponentLink1URL: http://10.3.1.109/ftp/public/Electronics/Datasheet/Panasonic%20ERJ%20Thick%20Film%20Chip%20Resistors.pdf
R?#22 = RES_120R_0603: Thick film Resistor 120R 5% 0603; Manufacturer: Panasonic; Manufacturer Part Number: ERJ-3GEYJ121V; PartCode: 1; Class Code: RES; Rated Voltage: 75V; Power: 0.1W; Case-Metric: 1608; Case-EIA: 0603; STD Price: 0.003; Part Number: RES_120R_0603; Type: Standard; Class: Thick film Resistor; ComponentLink1Description: Datasheet; ComponentLink1URL: http://10.3.1.109/ftp/public/Electronics/Datasheet/Panasonic%20ERJ%20Thick%20Film%20Chip%20Resistors.pdf
R?#24 = RES_3.3K_0603: Thick film Resistor 3.3K 5% 0603; Manufacturer: Panasonic; Manufacturer Part Number: ERJ-3GEYJ332V; PartCode: 1; Class Code: RES; Rated Voltage: 75V; Power: 0.1W; Case-Metric: 1608; Case-EIA: 0603; STD Price: 0.003; Part Number: RES_3.3K_0603; Type: Standard; Class: Thick film Resistor; ComponentLink1Description: Datasheet; ComponentLink1URL: http://10.3.1.109/ftp/public/Electronics/Datasheet/Panasonic%20ERJ%20Thick%20Film%20Chip%20Resistors.pdf
R?#25 = RES_1.8K_0603: Thick film Resistor 1.8K 5% 0603; Manufacturer: Panasonic; Manufacturer Part Number: ERJ-3GEYJ182V; PartCode: 1; Class Code: RES; Rated Voltage: 75V; Power: 0.1W; Case-Metric: 1608; Case-EIA: 0603; STD Price: 0.003; Part Number: RES_1.8K_0603; Type: Standard; Class: Thick film Resistor; ComponentLink1Description: Datasheet; ComponentLink1URL: http://10.3.1.109/ftp/public/Electronics/Datasheet/Panasonic%20ERJ%20Thick%20Film%20Chip%20Resistors.pdf
Rfbb?#1 Rfbb?#2 = CRCW040271K5FKED: Manufacturer Name: Vishay-Dale; PackageReference: CRCW040271K5FKED; Manufacturer Part Number: CRCW040271K5FKED
Rfbt?#1 Rfbt?#2 = CRCW04021M27FKED: Manufacturer Name: Vishay-Dale; PackageReference: CRCW04021M27FKED; Manufacturer Part Number: CRCW04021M27FKED
U1 U5 = THS3095D: Single-High-Voltage, Low Distortion, Current-Feedback Operational Amplifier with Power-Down, 10 to 30 V, -40 to 85 degC, 8-pin SOIC (D8), Green (RoHS & no Sb/Br); Alternate Manufacturer: Texas Instruments; Alternate PartNumber: Equivalent; 2nd Harmonic(dBc): 66; 3rd Harmonic(dBc): 74; @ MHz: 10; Acl, min stable gain(V/V): 1; BW @ Acl(MHz): 210; Diff Gain(%): 0.013; Diff Phase(deg): 0.02; Iib(Max)(nA): 20000; Io(Typ)(mA): 250; Iq per channel(Max)(mA): 11; Settling Time (0.1%)(Typ)(ns): 42; Slew Rate(Typ)(V/us): 7300; Sub Family: High Output Current Amplifier (>=50mA), High Speed Amplifier (>=50MHz), High Supply Voltage Amplifier (>=30V); THD (Fc is 1 MHz)(Typ)(dB): -75; Vio(Max)(mV): 4; Vn at Flatband(Typ)(nV/rtHz): 2; Vs(Max)(V): 30; DatasheetVersion: SLOS423G; PackageVersion: 4040047-3/M, 06/2011; PackageReference: D0008A; PackageDescription: 8-Pin Plastic Small Outline, Body 4.9 x 3.9 mm, Pitch 1.27 mm; Supplier 1: Digi-Key; Supplier Part Number 1: 296-16672-5-ND; Supplier 2: Newark; Supplier Part Number 2: 90H4521; Supplier 3: Mouser; Supplier Part Number 3: 595-THS3095D; Eco-Plan: Green (RoHS & no Sb/Br); Number of Channels: 1; Vs(Min)(V): 10; MountType: SMT; Code_JEDEC: MS-012; ComponentLink1Description: Manufacturer URL; ComponentLink1URL: http://www.ti.com/; ComponentLink2Description: Datasheet; ComponentLink2URL: http://www.ti.com/general/docs/lit/getliterature.tsp?genericPartNumber=THS3095&fileType=pdf; ComponentLink3Description: Package Specification; ComponentLink3URL: http://www.ti.com/litv/pdf/msoi002j; Manufacturer: Texas Instruments; PartNumber: THS3095D
U?#1 = TPS54202DDCR: IC OTHER TPS54202DDCR; Manufacturer: Texas Instruments; PartCode: 1; Case-EIA: SOT23; GR: BUCK; Manufacturer Part Number: TPS54202DDCR; Type: standard; Class: IC OTHER; Class Code: IC; ClassName: POWERIC
U?#2 = TPS71733DCKR: Single Output High PSRR LDO, 150 mA, Fixed 3.3 V Output, 2.5 to 6.5 V Input, with Low IQ, 5-pin SC70 (DCK), -40 to 85 degC, Green (RoHS & no Sb/Br); Manufacturer: Texas Instruments; Accuracy(%): 3; Fixed Output Options(V): 3.3; Iout(Max)(A): 0.15; Iq(Typ)(mA): 0.05; SubFamily: Single Channel LDO; Vdo(Typ)(mV): 170; Vin(Max)(V): 6.5; Vin(Min)(V): 2.5; Case-EIA: MO-203; DatasheetVersion: SBVS068G; PackageVersion: 4093553-3/G; PackageReference: DCK5; PackageDescription: 5-Pin Plastic Small-Outline, Body 2 x 1.25 mm, Pitch 0.65 mm; Supplier 1: Digi-Key; Supplier Part Number 1: 296-19675-2-ND; Supplier 2: Digi-Key; Supplier Part Number 2: 296-19675-1-ND; Supplier 3: Digi-Key; Supplier Part Number 3: 296-19675-6-ND; Supplier 4: Farnell; Supplier Part Number 4: 2120472; Supplier 5: Newark; Supplier Part Number 5: 94T5104; Supplier 6: Newark; Supplier Part Number 6: 85K1732; Supplier 7: Mouser; Supplier Part Number 7: 595-TPS71733DCKR; Eco-Plan: Green (RoHS & no Sb/Br); Vout Adj(Max)(V): 3.3; Vout Adj(Min)(V): 3.3; Mounting Technology: Surface Mount; Code_JEDEC: MO-203; PartNumber: TPS71733DCKR; ComponentLink1Description: Manufacturer URL; ComponentLink1URL: http://www.ti.com/; ComponentLink2Description: Datasheet; ComponentLink2URL: http://www.ti.com/general/docs/lit/getliterature.tsp?genericPartNumber=TPS71733&fileType=pdf; ComponentLink3Description: Package Specification; ComponentLink3URL: http://www.ti.com/litv/pdf/mpds025f; Manufacturer Part Number: TPS71733DCKR
U?#3 U?#8 = TLV61046ADBVR: Manufacturer Name: Texas Instruments; PackageReference: TLV61046ADBVR; Manufacturer Part Number: TLV61046ADBVR; Value: N/A
U?#4 = CMP-0793-00074-1: LC2MOS 4-Channel High Performance Analog Multiplexer, 40 Ohm / 90 Ohm Ron, 16-pin SOIC (R-16), Tube; Manufacturer: Analog Devices; Max Analog Signal Range: Vss to Vdd; Ron (ohms): 40; t transition (s): 120n; PackageDescription: 16-Pin Standard Small Outline Package, Body 9.9 x 3.9 mm, Pitch 1.27 mm; PackageReference: R-16; ComponentLink3URL: http://www.analog.com/static/imported-files/packages/PKG_PDF/SOIC_Narrow%20(R)/R_16.pdf; ComponentLink1URL: http://www.analog.com/en/index.html; Mounting Technology: Surface Mount; Packing: Tube; PartNumber: ADG409BR; ComponentLink3Description: Package Specification; ComponentLink1Description: Manufacturer URL; PackageVersion: 060606-A, 06/2006; ComponentLink2URL: http://www.analog.com/static/imported-files/data_sheets/ADG408_409.pdf; ComponentLink2Description: Datasheet; Code_JEDEC: MS-012-AC; DatasheetVersion: Rev. C
U?#5 = MSP430FR6047IPZR: Mixed-Signal Microcontroller, PZ0100A (LQFP-100); Manufacturer: Texas Instruments; SymbolCreator: Altium; SizeArea_mm2: 256; SizeAreaWB_mm2: 324; SizeX_mm: 16; SizeZ_mm: 1.6; CompType: IC; U/M: EA; SymbolVersion: 2016-11-29; PartNumber: MSP430FR6047IPZR; Alternate PartNumber: MSP430FR6047IPZ; PackageReference: PZ0100A; PackageDescription: LQFP-100; MountType: SMT; SizeY_mm: 16; ComponentLink1Description: Datasheet Link; ComponentLink1URL: https://sps06.itg.ti.com/sites/KMS/crossdivteams/altium/docs/ComponentDatasheets/SLASEB7_MSP430FR6047_Int.pdf; Publisher: Texas Instruments; LatestRevisionDate: 2016-11-30; Alternate Manufacturer: Texas Instruments
U?#7 = CMP-0694-00004-2: 3.3 V Supply RS-485 with IEC ESD Protection, 0.25 Mbps, -40 to 125 degC, 8-Pin SOIC, RoHS, Tape and Reel; Manufacturer: Texas Instruments; Manufacturer Part Number: ST485CDR; Manufacturer: STMicroelectronics; VI: -7 to 12 V; No. of RX: 1; ICC (Max) (mA): 0.95; ESD: 15 kV; VCC: 3 to 3.6 V; Signaling Rate (Max) (Mbps): 0.25; Packing: Tape and Reel; PackageReference: D0008A; ComponentLink3URL: http://www.ti.com/lit/ds/sllse11c/sllse11c.pdf; RoHS: TRUE; Operating Temperature Range: -40 to 125 degC; ComponentLink1Description: Manufacturer URL; Mounting Technology: Surface Mount; ComponentLink1URL: http://www.ti.com/; ComponentLink3Description: Package Specification; No. of TX: 1; PackageDescription: 8-Pin Plastic Small Outline, Body 4.9 x 3.9 mm, Pitch 1.27 mm; ComponentLink2Description: Datasheet; DatasheetVersion: SLLSE11C; ComponentLink2URL: http://www.ti.com/lit/ds/sllse11c/sllse11c.pdf; PackageVersion: 4040047-3/M; PartNumber: SN65HVD72DR
Y?#1 = AWSCR-8.00CV-T: Ceramic Resonator, 8MHz, 22pF, SMD; Manufacturer: Abracon Corporation; SymbolCreator: a0799721; SizeAreaWB_mm2: 19.27; SizeArea_mm2: 11.47; SizeX_mm: 3.7; SizeY_mm: 3.1; SizeZ_mm: 1.2; U/M: EA; TaMin_C: -25; TaMax_C: 85; SymbolVersion: 2016-2-15; PartNumber: AWSCR-8.00CV-T; CompType: Resonator; PackageReference: 3.7x3.1mm; MountType: SMT; RoHS: Y; ComponentLink1Description: Datasheet Link; ComponentLink1URL: http://www.abracon.com/Resonators/AWSCR_CV.pdf; Publisher: Texas Instruments; LatestRevisionDate: 2017-02-02; Supplier 1: Digi-Key; Supplier Part Number 1: 535-10004-1-ND; Supplier 2: Mouser; Supplier Part Number 2: 815-AWSCR-8.00CV-T
Y?#2 = ABM3-8.000MHZ-D2Y-T: Crystal, 8MHz, SMD; Manufacturer: Abracon Corporation; SymbolCreator: a0412235; U/M: EA; TaMin_C: -40; TaMax_C: 85; Frequency Stability: ±30ppm; SymbolVersion: 2008-07-09; PartNumber: ABM3-8.000MHZ-D2Y-T; CompType: Crystal; PackageReference: SMD, 2-Leads, Body 3.2x1.3x5 mm; MountType: SMT; RoHS: E; ComponentLink1Description: Datasheet Link; ComponentLink1URL: http://www.abracon.com/Resonators/abm3.pdf; Publisher: Texas Instruments; LatestRevisionDate: 2017-02-02; Supplier 1: Digi-Key; Supplier Part Number 1: 535-10630-1-ND; Supplier 2: Mouser; Supplier Part Number 2: 815-ABM3-8-D2Y-T; Supplier 3: Farnell; Supplier Part Number 3: 2101329
Y?#3 = ABS07-32.768KHZ-9-T: CRYSTAL, 32.768KHZ, 9PF, SMD; Manufacturer: Abracon Corporation; SymbolCreator: a0412235; U/M: EA; TaMin_C: -40; TaMax_C: 85; Frequency Stability: ±20ppm; SymbolVersion: 2008-07-09; PartNumber: ABS07-32.768KHZ-9-T; CompType: Crystal; PackageReference: 3.2x0.9x1.5mm; MountType: SMT; RoHS: Y; ComponentLink1Description: Datasheet Link; ComponentLink1URL: http://www.abracon.com/Resonators/ABS07.pdf; Publisher: Texas Instruments; LatestRevisionDate: 2016-11-29; Supplier 1: Digi-Key; Supplier Part Number 1: 535-9544-1-ND; Supplier 2: Mouser; Supplier Part Number 2: 815-ABS07-32.768K9T; Supplier 3: Farnell; Supplier Part Number 3: 2101346
Iout?#1 Iout?#2 = WB_CURRENT_LOAD: PackageReference: WB_CURRENT_LOAD; Manufacturer Part Number: WB_CURRENT_LOAD; Manufacturer Name: WB_CURRENT_LOAD; Value: N/A
Vin?#1 Vin?#2 = WB_BATTERY: PackageReference: WB_BATTERY; Manufacturer Part Number: WB_BATTERY; Manufacturer Name: WB_BATTERY; Value: N/A

## Sheet TIDA-01486E1_Hardware.SchDoc: Hardware
size 431 x 279 mm; Date: Not shown in title block; ApprovedBy: Not shown in title block; CheckedBy: Not shown in title block; Author: Not shown in title block; CompanyName: Not shown in title block; DrawnBy: Giovanni Campanella; Engineer: Giovanni Campanella; Organization: Not shown in title block; Address1: Not shown in title block; Address2: Not shown in title block; Address3: Not shown in title block; Address4: Not shown in title block; DocumentNumber: 1; Revision: Use project parameter SCH_Rev; SheetNumber: 3; SheetTotal: 3; PageSetup: Record=PageOptions|CenterHorizontal=True|CenterVertical=True|PrintScale=1.00|XCorrection=1.00|YCorrection=1.00|PrintKind=0|BorderSize=5000000|LeftOffset=0|BottomOffset=0|Orientation=2|PaperLength=1000|PaperWidth=1000|Scale=100|PaperSource=15|PrintQuality=600|MediaType=1|DitherType=10|PaperKind=Letter|PrintScaleMode=1; CurrentTime: Not shown in title block; CurrentDate: Not shown in title block; Time: Not shown in title block; DocumentFullPathAndName: Not shown in title block; DocumentName: Not shown in title block; ModifiedDate: Not shown in title block; ImagePath: Not shown in title block
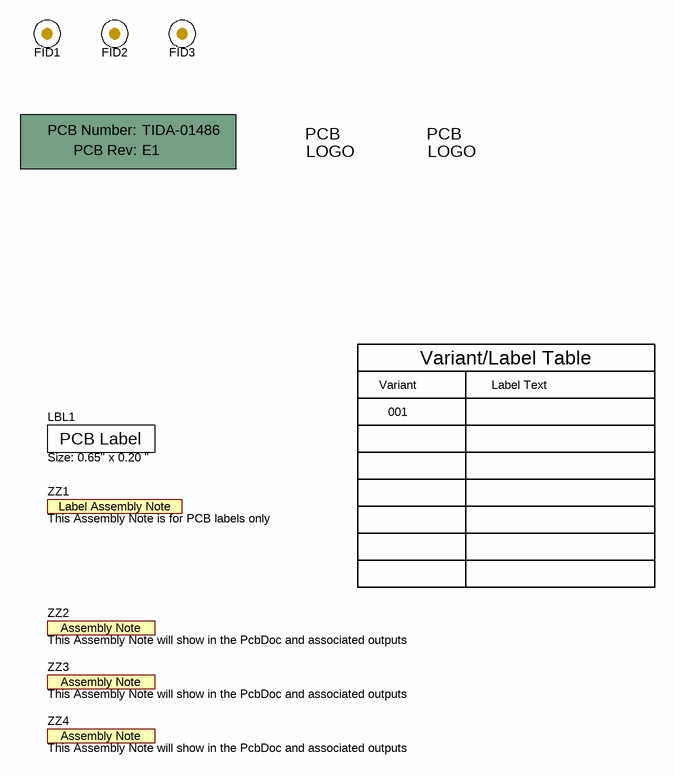
[diagram p7: TIDA-01486E1_Hardware.SchDoc]

### Parts
!PCB  Printed Circuit Board  (value not drawn)  (mechanical)
FID1  Fiducial  [Fiducial10-20]  (value not drawn)
FID2  Fiducial  [Fiducial10-20]  (value not drawn)
FID3  Fiducial  [Fiducial10-20]  (value not drawn)
LBL1  Size: 0.65" x 0.20 "  [Label_650x200]
Logo2  Pb-Free Symbol  [Pb-Free_Overlay_Small]  (value not drawn)  (no BOM)
Logo3  FCC disclaimer  [FCC_disclaimer]  (value not drawn)  (no BOM)
ZZ1  This Assembly Note is for PCB labels only  [AssemblyNoteLabel]  (no BOM)
ZZ2  This Assembly Note will show in the PcbDoc and associated outputs  [AssemblyNote]  (no BOM)
ZZ3  This Assembly Note will show in the PcbDoc and associated outputs  [AssemblyNote]  (no BOM)
ZZ4  This Assembly Note will show in the PcbDoc and associated outputs  [AssemblyNote]  (no BOM)

### Notes on the sheet
- Variant/Label Table
- Variant
- 001
- Label Text
- Drawn By:
- SVN Rev:
- Number:
- TID #:
- Orderable:
- Rev:
- Sheet Title:
- File:
- Project Title:
- Designed for:
- Assembly Variant:
- Mod. Date:
- Sheet:
- Size:
- of
- B
- http://www.ti.com
- Texas Instruments and/or its licensors do not warrant the accuracy or completeness of this specification or any information contained therein. Texas Instruments and/or its licensors do not warrant that this design will meet the specifications, will be suitable for your application or fit for any particular purpose, or will operate in an implementation. Texas Instruments and/or its licensors do not warrant that the design is production worthy. You should completely validate and test your design implementation to confirm the system functionality for your application.
- Engineer:
- Contact:
- © Texas Instruments
- (in symbol AssemblyNote) Assembly Note
- (in symbol AssemblyNoteLabel) Label Assembly Note
- (in symbol FCC_disclaimer) PCB; LOGO
- (in symbol Pb-Free) PCB; LOGO
- (in symbol PCB) PCB Number:; PCB Rev:
- (in symbol THT-14-423-10) PCB Label

### Library data of the parts
!PCB = PCB: Manufacturer: Any; PartNumber: TIDA-01486; SymbolCreator: a0412235; SymbolVersion: 2012-05-30; CompType: PCB; RoHS: O; MountType: N/A; Publisher: Texas Instruments; LatestRevisionDate: 2017-05-23
FID1-FID3 = Fiducial: Fiducial mark.  There is nothing to buy or mount.; SymbolCreator: codlsc; SymbolVersion: 2009-11-4; CompType: Fiducial; Publisher: Texas Instruments; LatestRevisionDate: 2016-12-05; LatestRevisionNote: Added Alternate PartNumber and Alternate Manufacturer parameters to appropriate components.; Manufacturer: N/A; MountType: N/A; PackageReference: N/A; PartNumber: N/A; ClassName: FiducialMark
LBL1 = THT-14-423-10: Thermal Transfer Printable Labels, 0.650" W x 0.200" H - 10,000 per roll; Manufacturer: Brady; SymbolCreator: a0412235; CompType: Label; Green_Lifecycle: Not Set; Green_REACh: Incomplete; SymbolVersion: 2012-06-12; ClassName: Label; PartNumber: THT-14-423-10; RoHS: Y; PackageReference: PCB Label 0.650 x 0.200 inch; MountType: N/A; ComponentLink1Description: Web Page; ComponentLink1URL: http://www.bradyid.com/bradyid/pdpv/THT-14-423-10.html; Note: Size: 0.65" x 0.20 "; Publisher: Texas Instruments; LatestRevisionDate: 2017-05-23; Supplier 1: Newark; Supplier Part Number 1: 97C5133; Supplier 2: Farnell; Supplier Part Number 2: 2065596; Green_EU RoHS-2: Incomplete; Green_EU RoHS: Incomplete
Logo2 = Pb-Free: SymbolCreator: a0412235; SymbolVersion: 2011-08-22; Published: 2009-03-03; Publisher: Texas Instruments; LatestRevisionDate: 2016-03-21
Logo3 = FCC_disclaimer: SymbolCreator: a0412235; SymbolVersion: 2016-03-21; Published: 2009-03-03; Publisher: Texas Instruments; LatestRevisionDate: 2016-03-21
ZZ1 = AssemblyNoteLabel: SymbolCreator: a0412235; SymbolVersion: 2012-06-14; CompType: AssemblyNote; ClassName: AssemblyNote; Publisher: Texas Instruments; LatestRevisionDate: 2017-05-23
ZZ2-ZZ4 = AssemblyNote: SymbolCreator: codlsc; SymbolVersion: 2010-05-18; CompType: AssemblyNote; ClassName: AssemblyNote; Publisher: Texas Instruments; LatestRevisionDate: 2017-05-23

## Assembly variants
001: not fitted C51 C52 C53 C54 FID1 FID2 FID3